# Altium schematic sheet Power.SchDoc
size A4; SheetNumber: 2; SheetTotal: 4
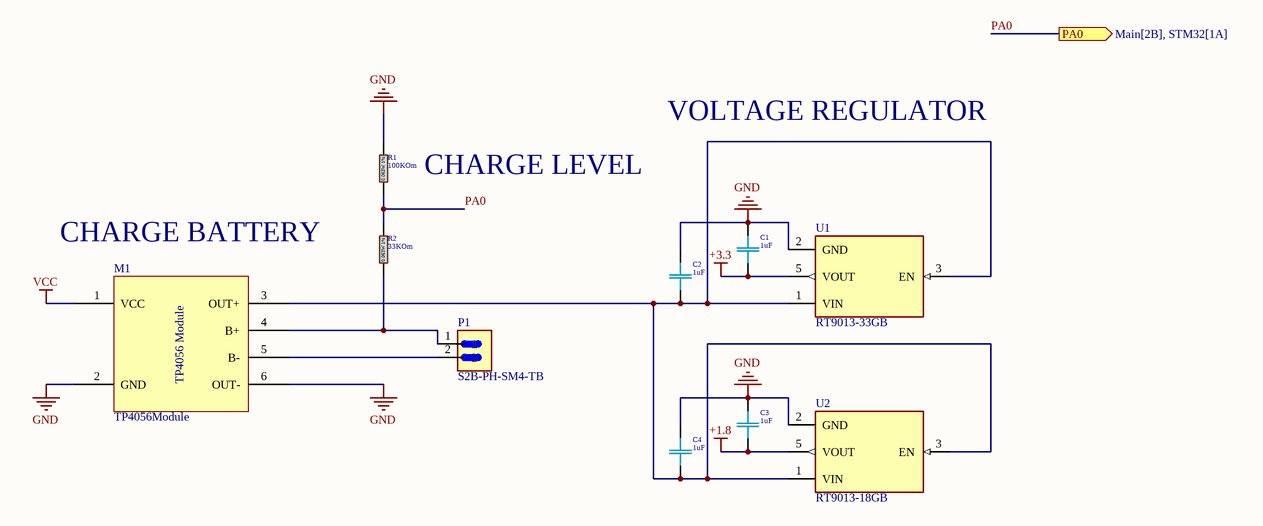
[diagram p0: Power.SchDoc]

## Parts
C1  1uF  [C 0402(1005)x0.5]
C2  1uF  [C 0402(1005)x0.5]
C3  1uF  [C 0402(1005)x0.5]
C4  1uF  [C 0402(1005)x0.5]
M1  TP4056Module  [TP4056Module]
P1  S2B-PH-SM4-TB  [JST_S2B-PH-SM4-TB]
R1  100KOm  [R 0402(1005)-1%]
R2  33KOm  [R 0402(1005)-1%]
U1  RT9013-33GB  [SOT94P279X129-5N]
U2  RT9013-18GB  [SOT94P279X129-5N]

## Ports
PA0 (out, see Main[2B], STM32[1A])

## Nets
+1.8: C3.2 U2.5(VOUT)
+3.3: C1.2 U1.5(VOUT)
GND: C1.1 C2.1 C3.1 C4.1 M1.2(GND) M1.6(OUT-) R1.2 U1.2(GND) U2.2(GND)
VCC: M1.1(VCC)
PA0: R1.1 R2.2 ; port PA0
NetC2_2: C2.2 C4.2 M1.3(OUT+) U1.1(VIN) U1.3(EN) U2.1(VIN) U2.3(EN)
NetM1_4: M1.4(B+) P1.1 R2.1
NetM1_5: M1.5(B-) P1.2

## Notes on the sheet
- VOLTAGE REGULATOR
- (near R1) CHARGE LEVEL
- CHARGE BATTERY
- (in symbol R 0402-1%) 0.063W 1%
- (in symbol TP4056Module) TP4056 Module

## Library data of the parts
C1-C4 = C 0402    16V X5R - 0*: SMD 0402     16V X5R 10%; Manufacturer: Samsung; TYPE: Capacitors; Tolerance %: ±20%; Package-mm: 1005; Part Number: *; Mount Type: SMT; Publisher: Hefest; Manufacturer Alternate: *; Part Number Alternate: *; Published: 07.04.2019; Supplier 1: Comet; Supplier Part Number 1: *; RoHS: Y; Technology: Ceramic  MLCC; Package: 0402; VDC: 16V; TempCo: X5R; VAC: *; ESR Ohm: *; ComponentLink1Description: Datasheet Link; ComponentLink1URL: https://store.comet.bg/download-file.php?id=11; Temperature Range: -55°C ~ +85°C; Price: *; Value: 1uF
M1 = TP4056Module: TP4056 Module for managing battery charging
P1 = S2B-PH-SM4-TB: Connector Header Surface Mount, Right Angle 2 position 0.079 (2.00mm); MF: JST Sales; Price: None; Availability: In Stock; Package: None; MP: S2B-PH-SM4-TB; Value: *; SnapEDA_Link: https://www.snapeda.com/parts/S2B-PH-SM4-TB/JST+Sales+America+Inc./view-part/?ref=snap; Purchase-URL: https://pricing.snapeda.com/search/part/S2B-PH-SM4-TB/?ref=eda; Check_prices: https://www.snapeda.com/parts/S2B-PH-SM4-TB/JST+Sales+America+Inc./view-part/?ref=eda
R1 R2 = R 0402-1%: SMD 0402 0.063W 1%   50V; Manufacturer: YAGEO; TempCo: ±100ppm/°C; Package-mm: 1005; Value Code: 1001; Power: 0.0625W; Part Number: *; Mount Type: SMT; Publisher: Hefest; Manufacturer Alternate: *; Published: 07.04.2019; Supplier 1: Comet; Supplier Part Number 1: R0402 1.0K 1% YAG/ASJ; RoHS: Y; Technology: Thick film; Package: 0402; VDC: 50V; Tolerance %: ±1%; ComponentLink1Description: Datasheet Link; ComponentLink1URL: https://store.comet.bg/download-file.php?id=1224; Temperature Range: -55°C ~ +155°C; Price: 0.015; Part Number Alternate: *; TYPE: Resistor
  R1: Value: 100KOm
  R2: Value: 33KOm
U1 U2 = RT9013-33GB: Linear Voltage Regulator IC 1 Output 500mA SOT-23-5; MF: Richtek USA; Availability: Unavailable; Price: None; SnapEDA_Link: https://www.snapeda.com/parts/RT9013-33GB/Richtek%20USA%20Inc./view-part/553199/?ref=snap; Value: *; MP: RT9013-33GB; Package: SOT-23-5 Richtek